# EAGLE design Screwduinov2 (EAGLE 5.10)
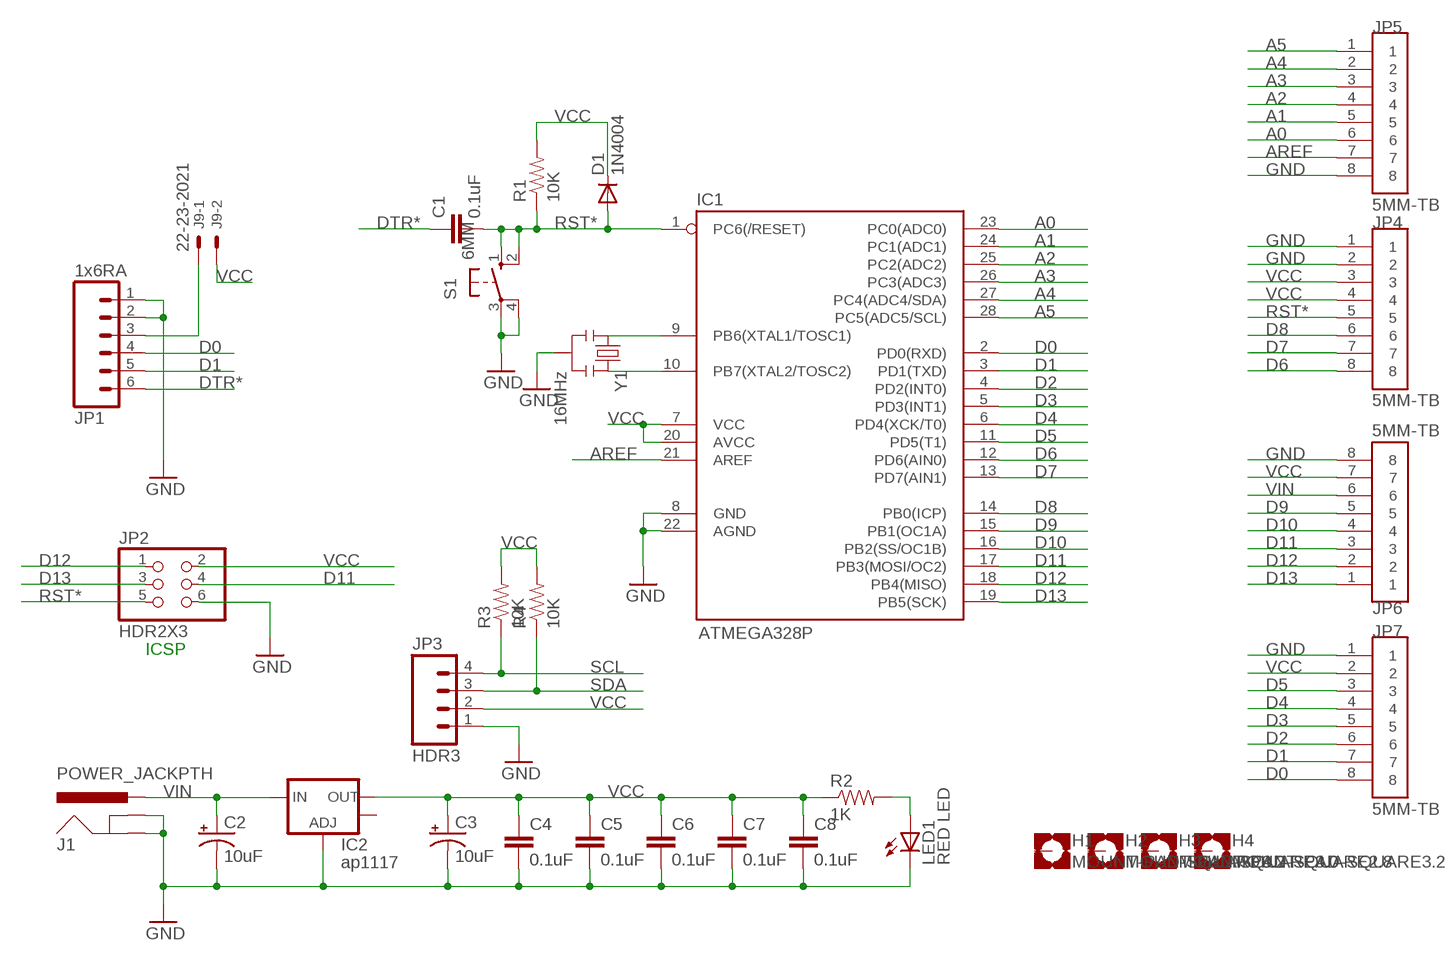
[diagram p0: schematic, sheet 1]

## Parts
C1  0.1uF  CAPKIT  [CAP-PTH-SMALL-KIT]
C2  10uF  CAP_POLPTH2  [CPOL-RADIAL-10UF-25V]
C3  10uF  CAP_POLPTH2  [CPOL-RADIAL-10UF-25V]
C4  0.1uF  CAPPTH2  [CAP-PTH-SMALL2]
C5  0.1uF  CAPPTH2  [CAP-PTH-SMALL2]
C6  0.1uF  CAPPTH2  [CAP-PTH-SMALL2]
C7  0.1uF  CAPPTH2  [CAP-PTH-SMALL2]
C8  0.1uF  CAPPTH2  [CAP-PTH-SMALL2]
D1  1N4004  [DO41-10]
H1  MOUNT-PAD-SQUARE3.2  [3,2-PAD-SQUARE]
H2  MOUNT-PAD-SQUARE3.0  [3,0-PAD-SQUARE]
H3  MOUNT-PAD-SQUARE2.8  [2,8-PAD-SQUARE]
H4  MOUNT-PAD-SQUARE3.2  [3,2-PAD-SQUARE]
IC1  ATMEGA328P  AVR-MEGA8-PPTH  [DIL28-3]
IC2  ap1117  V_REG_LM1117SOT223  [SOT223]
J1  POWER_JACKPTH  [POWER_JACK_PTH]
J9  22-23-2021  [22-23-2021]
JP1  1x6RA  M06POLAR_LOCK  [MOLEX-1X6_LOCK]
JP2  HDR2X3  PINHD-2X3  [2X03]
JP3  HDR3  M04POLAR  [MOLEX-1X4]
JP4  5MM-TB  [5MM-TB]
JP5  5MM-TB  [5MM-TB]
JP6  5MM-TB  [5MM-TB]
JP7  5MM-TB  [5MM-TB]
LED1  RED LED  LED5MM  [LED5MM]
R1  10K  RESISTORPTH-1/4W  [AXIAL-0.4]
R2  1K  RESISTORPTH-1/4W  [AXIAL-0.4]
R3  10K  RESISTORPTH-1/4W  [AXIAL-0.4]
R4  10K  RESISTORPTH-1/4W  [AXIAL-0.4]
S1  6MM  10-XX  [B3F-10XX]
Y1  16MHz  RESONATORPTH  [RESONATOR-PTH]

## Nets
A0: IC1.23(PC0(ADC0)) JP5.6
A1: IC1.24(PC1(ADC1)) JP5.5
A2: IC1.25(PC2(ADC2)) JP5.4
A3: IC1.26(PC3(ADC3)) JP5.3
A4: IC1.27(PC4(ADC4/SDA)) JP5.2
A5: IC1.28(PC5(ADC5/SCL)) JP5.1
AREF: IC1.21(AREF) JP5.7
D0: IC1.2(PD0(RXD)) JP1.4 JP7.8
D1: IC1.3(PD1(TXD)) JP1.5 JP7.7
D2: IC1.4(PD2(INT0)) JP7.6
D3: IC1.5(PD3(INT1)) JP7.5
D4: IC1.6(PD4(XCK/T0)) JP7.4
D5: IC1.11(PD5(T1)) JP7.3
D6: IC1.12(PD6(AIN0)) JP4.8
D7: IC1.13(PD7(AIN1)) JP4.7
D8: IC1.14(PB0(ICP)) JP4.6
D9: IC1.15(PB1(OC1A)) JP6.5
D10: IC1.16(PB2(SS/OC1B)) JP6.4
D11: IC1.17(PB3(MOSI/OC2)) JP2.4 JP6.3
D12: IC1.18(PB4(MISO)) JP2.1 JP6.2
D13: IC1.19(PB5(SCK)) JP2.3 JP6.1
DTR*: C1.1 JP1.6
GND: C2.2(-) C3.2(-) C4.2 C5.2 C6.2 C7.2 C8.2 IC1.8(GND) IC1.22(AGND) IC2.1(ADJ) J1.GND J1.GNDBREAK JP1.1 JP1.2 JP2.6 JP3.1 JP4.1 JP4.2 JP5.8 JP6.8 JP7.1 LED1.K(C) S1.3(P) S1.4(P1) Y1.2
N$1: IC1.9(PB6(XTAL1/TOSC1)) Y1.1
N$2: IC1.10(PB7(XTAL2/TOSC2)) Y1.3
N$4: J9.1 JP1.3
N$5: LED1.A R2.P$2
RST*: C1.2 D1.A IC1.1(PC6(/RESET)) JP2.5 JP4.5 R1.P$1 S1.1(S) S1.2(S1)
SCL: JP3.4 R3.P$1
SDA: JP3.3 R4.P$1
VCC: C3.1(+) C4.1 C5.1 C6.1 C7.1 C8.1 D1.C IC1.7(VCC) IC1.20(AVCC) IC2.2(OUT) J9.2 JP2.2 JP3.2 JP4.3 JP4.4 JP6.7 JP7.2 R1.P$2 R2.P$1 R3.P$2 R4.P$2
VIN: C2.1(+) IC2.3(IN) J1.PWR JP6.6
Unconnected: H1.B3,2(MOUNT) H2.B3,0(MOUNT) H3.B2,8(MOUNT) H4.B3,2(MOUNT) IC2.4(OUT)

## Notes on the sheet
- ICSP

## Library data of the parts
C1 C4-C8 = SparkFun:CAP: Capacitor Standard 0603 ceramic capacitor, and 0.1" leaded capacitor.
C2 C3 = SparkFun:CAP_POL: Capacitor Polarized These are standard SMD and PTH capacitors. Normally 10uF, 47uF, and 100uF in electrolytic and tantalum varieties. Always verify the external diameter of the through hole cap, it varies with capacity, voltage, and manufacturer. The EIA devices should be standard.
D1 = diode:1N4004: DIODE general purpose rectifier, 1 A
H1-H4 = holes:MOUNT-PAD-SQUARE: MOUNTING PAD, square
IC1 = SparkFun:AVR-MEGA8-P: MICROCONTROLLER 8 Kbytes FLASH 1 kbytes SRAM 512 bytes EEPROM USART 4-channel 10 bit ADC 2-channel 8 bit ADC
IC2 = SparkFun:V_REG_LM1117: Voltage Regulator LM1117 Standard adjustable voltage regulator but in SMD form. Spark Fun Electronics SKU : COM-00595
J1 = SparkFun:POWER_JACK: Power Jack This is the standard 5.5mm barrel jack for power. The PTH is the most common, proven, reliable, footprint. All others are experimental. The Slot footprint only works if the mill layer is transmitted to the PCB fab house so be warned. Spark Fun Electronics SKU : PRT-00119. Mating wall wart : TOL-00298 (and others)
J9 = con-molex:22-23-2021: .100" (2.54mm) Center Header - 2 Pin
JP1 = SparkFun:M06: Header 6 Standard 6-pin 0.1" header. Use with straight break away headers (SKU : PRT-00116), right angle break away headers (PRT-00553), swiss pins (PRT-00743), machine pins (PRT-00117), and female headers (PRT-00115). Molex polarized connector foot print use with SKU : PRT-08094 with associated crimp pins and housings. NOTES ON THE VARIANTS LOCK and LOCK_LONGPADS... This footprint was designed to help hold the alignment of a through-hole component (i.e. 6-pin header) while soldering it into place. You may notice that each hole has been shifted either up or down by 0.005 of an inch from it's more standard position (which is a perfectly straight line). This slight alteration caused the pins (the squares in the middle) to touch the edges of the holes. Because they are alternating, it causes a "brace" to hold the component in place. 0.005 has proven to be the perfect amount of "off-center" position when using our standard breakaway headers. Although looks a little odd when you look at the bare footprint, once you have a header in there, the alteration is very hard to notice. Also, if you push a header all the way into place, it is covered up entirely on the bottom side. This idea of altering the position of holes to aid alignment will be further integrated into the Sparkfun Library for other footprints. It can help hold any component with 3 or more connection pins.
JP2 = SparkFun:PINHD-2X3: PIN HEADER
JP3 = SparkFun:M04: Header 4 Standard 4-pin 0.1" header. Use with straight break away headers (SKU : PRT-00116), right angle break away headers (PRT-00553), swiss pins (PRT-00743), machine pins (PRT-00117), and female headers (PRT-00115). Molex polarized connector foot print use with SKU : PRT-08231 with associated crimp pins and housings. 1MM SMD Version SKU: PRT-10208
JP4-JP7 = arduino:5MM-TB: 5MM TERM BLK
LED1 = SparkFun:LED: LEDs Standard schematic elements and footprints for 5mm, 3mm, 1206, and 0603 sized LEDs. 5mm - Spark Fun Electronics SKU : COM-00529 (and others)
R1-R4 = SparkFun:RESISTOR: Resistor Basic schematic elements and footprints for 0603, 1206, and PTH resistors.
S1 = switch-omron:10-XX: OMRON SWITCH
Y1 = SparkFun:RESONATOR: Resonator Small SMD resonator. This is the itty bitty 10/20MHz resonators with built in caps. CSTCE10M0G55 and CSTCE20M0V53. Footprint has been reviewed closely but hasn't been tested yet.

## Board
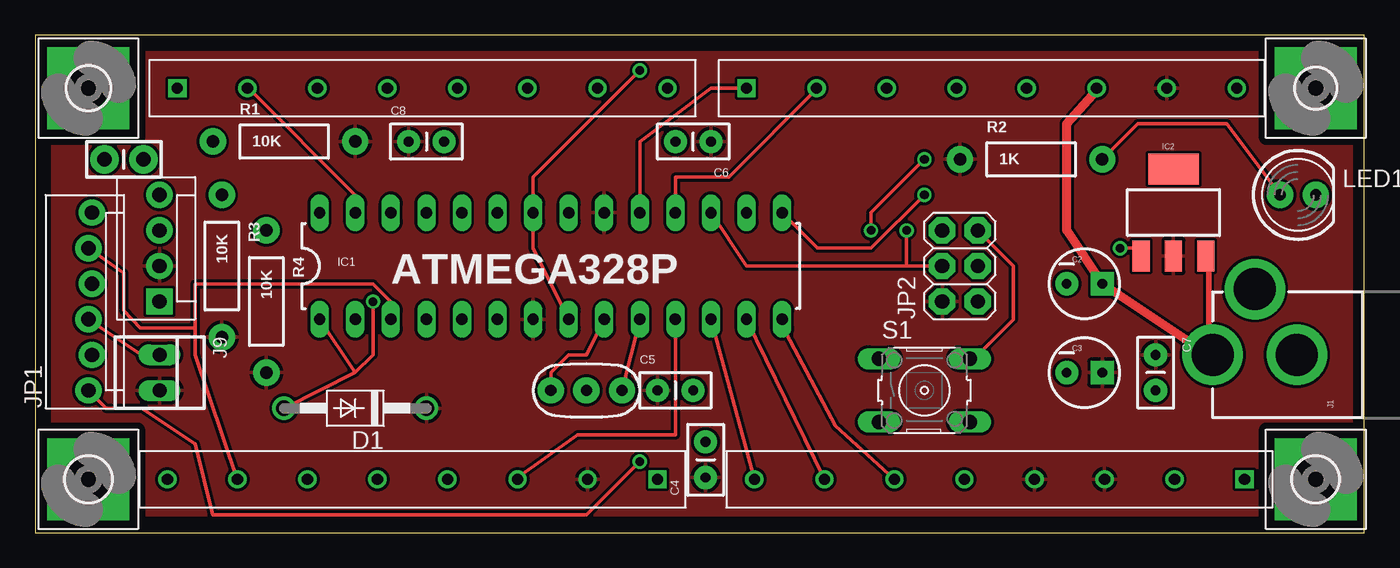
[diagram p1: board, top side]
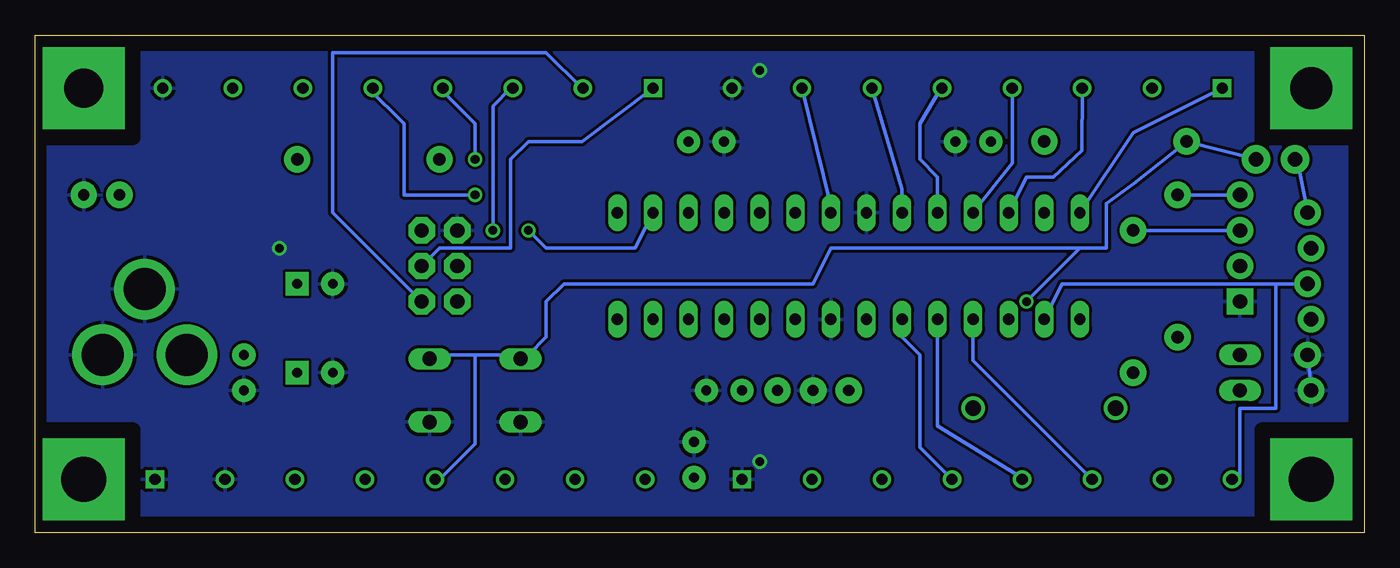
[diagram p2: board, bottom side, seen from below]

Size 94.92 x 35.55 mm. Coordinates in mm from the lower left corner, seen from the top.
Outline: 0,0 94.92,0 94.92,35.55 0,35.55 0,0
Copper layers (1*16): Top 0.035mm / dielectric 1.5mm / Bottom 0.035mm
Design rules "default *": minimum track width 10mil, minimum drill 24mil, track to track 8mil, track to pad 8mil, pad to pad 8mil, via to via 8mil, smd to smd 8mil, copper to edge 10mil, drill to drill 8mil, minimum pad ring 10mil, minimum via ring 8mil, stop-mask expansion 4mil, vias tented up to drill 0mil, thermal gap 10mil

### Footprints (pad centres in the part's own frame; a part is rotated, then mirrored left to right if it is on the bottom)
CAP-PTH-SMALL-KIT = drill 1.016 pad 2.032 round: 1 -1.397,0; 2 1.397,0
CPOL-RADIAL-10UF-25V = drill 0.7 pad 1.651 square: 1 1.27,0 | drill 0.7 pad 1.651 round: 2 -1.27,0
CAP-PTH-SMALL2 = drill 0.7 pad 1.651 round: 1 0,0; 2 2.54,0
DO41-10 = drill 1.118 round: A 5.08,0; C -5.08,0
3,2-PAD-SQUARE = drill 3.2 pad 5.842 square: B3,2 0,0
3,0-PAD-SQUARE = drill 3 pad 5.842 square: B3,0 0,0
2,8-PAD-SQUARE = drill 2.8 pad 5.842 square: B2,8 0,0
DIL28-3 = drill 0.813 long: 1 -16.51,-3.81; 2 -13.97,-3.81; 3 -11.43,-3.81; 4 -8.89,-3.81; 5 -6.35,-3.81; 6 -3.81,-3.81; 7 -1.27,-3.81; 8 1.27,-3.81; 9 3.81,-3.81; 10 6.35,-3.81; 11 8.89,-3.81; 12 11.43,-3.81; 13 13.97,-3.81; 14 16.51,-3.81; 15 16.51,3.81; 16 13.97,3.81; 17 11.43,3.81; 18 8.89,3.81; 19 6.35,3.81; 20 3.81,3.81; 21 1.27,3.81; 22 -1.27,3.81; 23 -3.81,3.81; 24 -6.35,3.81; 25 -8.89,3.81; 26 -11.43,3.81; 27 -13.97,3.81; 28 -16.51,3.81
SOT223 = smd 1.219 x 2.235: 1 -2.311,-3.099; 2 0,-3.099; 3 2.311,-3.099 | smd 3.6 x 2.2: 4 0,3.099
POWER_JACK_PTH = drill 2.997 pad 4.318 round: GND 0,7.7; GNDBREAK 4.7,10.7; PWR 0,13.7
22-23-2021 = drill 1 long: 1 -1.27,0; 2 1.27,0
MOLEX-1X6_LOCK = drill 1.016 pad 1.88 round: 1 0,0; 2 2.54,-0.254; 3 5.08,0; 4 7.62,-0.254; 5 10.16,0; 6 12.7,-0.254
2X03 = drill 1.016 pad 1.88 octagon: 1 -2.54,-1.27; 2 -2.54,1.27; 3 0,-1.27; 4 0,1.27; 5 2.54,-1.27; 6 2.54,1.27
MOLEX-1X4 = drill 1.016 pad 1.88 square: 1 0,0 | drill 1.016 pad 1.88 round: 2 2.54,0; 3 5.08,0; 4 7.62,0
5MM-TB = drill 0.8 square: 1 0,0 | drill 0.8 round: 2 5,0; 3 10,0; 4 15,0; 5 20,0; 6 25,0; 7 30,0; 8 35,0
LED5MM = drill 0.813 pad 1.88 round: A -1.27,0; K 1.27,0
AXIAL-0.4 = drill 0.9 pad 1.88 round: P$1 -5.08,0; P$2 5.08,0
B3F-10XX = drill 1.016 long: 1 -3.251,2.261; 2 3.251,2.261; 3 -3.251,-2.261; 4 3.251,-2.261
RESONATOR-PTH = drill 0.8 pad 1.88 round: 1 -2.54,0; 2 0,0; 3 2.54,0

### Placement (x,y rotation side)
C1  6.35,26.67 0 top
C2  74.93,17.78 0 top
C3  74.93,11.43 0 top
C4  47.88,3.94 90 top
C5  44.45,10.16 0 top
C6  48.26,27.94 180 top
C7  80.01,12.7 270 top
C8  26.67,27.94 0 top
D1  22.86,8.89 180 top
H1  91.44,3.81 0 top
H2  3.81,31.75 0 top
H3  91.44,31.75 0 top
H4  3.81,3.81 0 top
IC1  36.83,19.05 0 top
IC2  81.28,22.86 0 top
J1  97.79,12.7 90 top
J9  8.89,11.43 270 top
JP1  3.81,10.16 90 top
JP2  66.04,19.05 90 top
JP3  8.89,16.51 90 top
JP4  86.36,3.81 180 top
JP5  10.16,31.75 0 top
JP6  50.8,31.75 0 top
JP7  44.45,3.81 180 top
LED1  90.17,24.13 0 top
R1  17.78,27.94 0 top
R2  71.12,26.67 0 top
R3  13.34,19.05 270 top
R4  16.51,16.51 270 top
S1  63.5,10.16 0 top
Y1  39.37,10.16 0 top

### Tracks (layer width: path | path; a pad name or v marks a point on that pad's centre or on a via)
A0
  Bottom 0.254: JP5.6 33.02,24.53 IC1.23
A1
  Bottom 0.254: IC1.24 30.48,25.4 31.75,26.67 31.75,29.21 30.23,31.75 JP5.5
A2
  Bottom 0.254: IC1.25 25.15,26.42 25.15,31.62 JP5.4
A3
  Bottom 0.254: IC1.26 24.13,25.4 22.23,25.4 20.19,27.3 JP5.3
A4
  Top 0.254: IC1.27 22.86,24.13 15.24,31.75 JP5.2
A5
  Bottom 0.254: IC1.28 16.51,28.57 JP5.1
AREF
  Bottom 0.254: JP5.7 38.1,23.34 IC1.21
D0
  Bottom 0.254: 6.35,17.78 21.59,17.78 IC1.2 | 6.35,17.78 6.35,8.89 8.89,8.89 8.89,3.81 JP7.8 | 6.35,17.78 JP1.4 3.81,17.78
D1
  Top 0.254: 11.43,14.61 11.43,12.7 JP7.7 | 11.43,14.61 11.43,17.78 24.13,17.78 25.4,16.51 IC1.3 | 11.43,14.61 7.49,14.61 6.35,15.88 6.35,18.54 JP1.5
D2
  Bottom 0.254: JP7.6 27.94,12.3 IC1.4
D3
  Bottom 0.254: JP7.5 24.38,3.88 30.48,7.62 IC1.5
D4
  Bottom 0.254: JP7.4 31.75,6.11 31.75,12.7 33.02,13.97 IC1.6
D5
  Top 0.254: JP7.3 34.29,3.81 38.73,6.99 45.72,6.99 IC1.11
D6
  Top 0.254: JP4.8 IC1.12
D7
  Top 0.254: JP4.7 IC1.13
D8
  Top 0.254: JP4.6 57.15,7.62 53.34,14.8 IC1.14
D9  (via drill 0.61)
  Top 0.254: v63.5,24.13 59.69,20.32 55.88,20.32 IC1.15
  Bottom 0.254: v63.5,24.13 68.58,24.13 68.58,29.21 71.12,31.75 JP6.5
D10  (via drill 0.61)
  Top 0.254: v63.5,26.67 59.69,22.86 v59.69,21.59
  Bottom 0.254: v63.5,26.67 63.5,29.21 66.04,31.75 JP6.4 | v59.69,21.59 58.42,20.32 52.07,20.32 IC1.16
D11  (via drill 0.61)
  Top 0.254: IC1.17 50.8,19.05 62.23,19.05 | 62.23,19.05 JP2.4 | 62.23,19.05 v62.23,21.59
  Bottom 0.254: v62.23,21.59 62.23,30.48 60.96,31.75 JP6.3
D12
  Top 0.254: JP6.2 55.88,31.75 49.53,25.4 45.72,25.4 IC1.18
  Bottom 0.254: JP2.1 73.66,22.86 73.66,34.29 58.42,34.29 55.88,31.75 JP6.2
D13
  Top 0.254: JP6.1 48.26,31.75 43.18,27.94 IC1.19
  Bottom 0.254: JP6.1 55.88,27.94 59.69,27.94 60.96,26.67 60.96,20.32 66.04,20.32 JP2.3
DTR*
  Bottom 0.254: C1.1 4.83,26.8 JP1.6
GND  (via drill 0.61)
  Top 0.254: v77.47,20.32 78.74,20.32 IC2.1 | v43.18,33.02 35.56,25.4 IC1.22 35.56,20.32 IC1.8 | v43.18,5.08 39.37,1.27 12.7,1.27 11.43,6.35 7.62,8.89 5.08,8.89 JP1.1
  Bottom 0.254: JP1.2 3.94,11.68 JP1.1
  pour Bottom: 1.27,34.29 1.27,1.27 93.98,1.27 93.98,34.29
N$1
  Top 0.254: Y1.1 36.83,11.43 38.1,12.7 39.37,12.7 IC1.9
N$2
  Top 0.254: Y1.3 IC1.10
N$3
  pour Bottom: 39.37,16.51 39.37,13.97 38.1,12.7 36.83,12.7 35.56,11.43 35.56,10.16 35.56,8.89 43.18,8.89 43.18,12.7 44.45,12.7 44.45,16.51
N$4
  Top 0.254: J9.1 7.62,12.7 JP1.3
N$5
  Top 0.254: LED1.A 85.09,29.21 78.74,29.21 R2.P$2
RST*  (via drill 0.61)
  Top 0.254: D1.A 22.86,11.43 | 22.86,11.43 IC1.1 | JP2.5 69.85,19.05 69.85,15.24 67.31,12.7 S1.2 | 22.86,11.43 24.13,12.7 v24.13,16.51
  Bottom 0.254: C1.2 R1.P$1 arc3 18.41,23.5 18.41,20.32 20.32,20.32 | 20.32,20.32 38.1,20.32 39.37,17.78 57.15,17.78 58.42,16.51 58.42,13.97 59.69,12.7 60.96,12.7 | 60.96,12.7 63.5,12.7 | 63.5,12.7 66.47,12.7 S1.2 | 63.5,12.7 63.5,6.35 66.04,3.81 JP4.5 | 60.96,12.7 S1.1 | v24.13,16.51 20.32,20.32
SCL
  Bottom 0.254: JP3.4 R3.P$1
SDA
  Bottom 0.254: JP3.3 R4.P$1
VCC
  pour Top: 1.27,34.29 1.27,1.27 93.98,1.27 93.98,34.29
VIN
  Top 0.254: 83.82,19.53 IC2.3 | 75.82,31.62 JP6.6 | 83.82,12.7 J1.PWR
  Top 0.381: 83.82,12.7 83.82,19.53
  Top 0.635: 75.82,31.62 73.66,29.21 73.66,21.59 C2.1 83.82,12.7

### Text on the board
tPlace: ATMEGA328P